# Altium schematic sheet buck_boost_converter.SchDoc
size 297 x 209 mm; DrawnBy: Supun; Engineer: Supun; Organization: C3
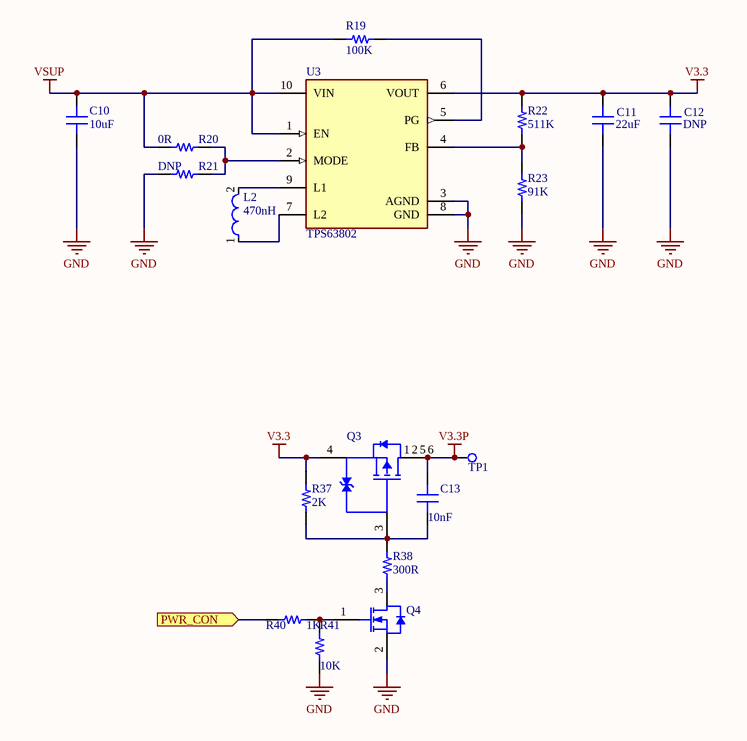
[diagram p0: buck_boost_converter.SchDoc]

## Parts
C10  10uF  [CAP 0603_1608]
C11  22uF  [CAP 0603_1608]
C12  DNP  [CAP 0603_1608]
C13  10nF  [CAP 0603_1608]
L2  470nH  [Coilcraft_XFL4015_MFG]
Q3  P Mosfet  [Diodes_Inc._TSOT26_MFG]  (value not drawn)
Q4  N Mosfet  [ON SEMI SOT-23-3]  (value not drawn)
R19  100K  [RES 0603_1608]
R20  0R  [RES 0603_1608]
R21  DNP  [RES 0603_1608]
R22  511K  [RES 0603_1608]
R23  91K  [RES 0603_1608]
R37  2K  [RES 0603_1608]
R38  300R  [RES 0603_1608]
R40  1K  [RES 0603_1608]
R41  10K  [RES 0603_1608]
TP1  Test Point  [TPSMD_S1]  (value not drawn)
U3  TPS63802  [Texas_Instruments_DLA0010A_MFG]

## Ports
PWR_CON (in)

## Nets
GND: C10.2 C11.2 C12.2 Q4.2(S) R21.1 R23.2 R41.1 U3.3(AGND) U3.8(GND)
V3.3: C11.1 C12.1 Q3.4(S) R22.1 R37.1 U3.6(VOUT)
V3.3P: C13.1 Q3.1(D) Q3.2(D) Q3.5(D) Q3.6(D) TP1.1(TP)
VSUP: C10.1 R19.1 R20.1 U3.1(EN) U3.10(VIN)
PWR_CON: R40.1 ; port PWR_CON
NetC13_2: C13.2 Q3.3(G) R37.2 R38.2
NetL2_1: L2.1 U3.7(L2)
NetL2_2: L2.2 U3.9(L1)
NetQ4_1: Q4.1(G) R40.2 R41.2
NetQ4_3: Q4.3(D) R38.1
NetR19_2: R19.2 U3.5(PG)
NetR20_2: R20.2 R21.2 U3.2(MODE)
NetR22_2: R22.2 R23.1 U3.4(FB)

## Notes on the sheet
- Title
- Size:
- Date:
- A4
- Number:
- Time:
- Revision:
- Sheet
- of
- File:

## Library data of the parts
C10 = Capacitor: SMT Capacitor; MF: Murata; MP: GRM188R61C106MAALD; Value: 10uF; Link: https://www.mouser.com/ProductDetail/Murata-Electronics/GRM188R61C106MAALD?qs=hNud%2FORuBR3LEOKZ4RJp9w%3D%3D
C11 C12 = Capacitor: SMT Capacitor; MF: Murata; MP: GRM188R61A226ME15D; Link: https://www.mouser.com/ProductDetail/Murata-Electronics/GRM188R61A226ME15D?qs=eeBpzGFlv%252B8DV%2FrilzyhAw%3D%3D
  C11: Value: 22uF
  C12: Value: DNP
C13 = Capacitor: SMT Capacitor; MF: Murata; MP: GRM1885C1E103JA01D; Value: 10nF; Link: https://www.mouser.com/ProductDetail/Murata-Electronics/GRM1885C1E103JA01D?qs=ui%252B2d9lVEI4mHR%2FJ9wCzmw%3D%3D
L2 = Inductor_sm: Fixed Inductors 2.2uH 20% High Temp AEC-Q200; MF: Coilcraft; MP: XFL4015-471MEC; Value: 470nH; Link: https://www.mouser.com/ProductDetail/Coilcraft/XFL4015-471MEC?qs=zCSbvcPd3pYzCOJSVbeMnw%3D%3D
Q3 = Mosfet-P-6_ESD: P-Channel Enhancement Mode MOS Transistor, 3-Pin SOT23; MF: Vishay; MP: SI3421DV-T1-GE3; Value: P Mosfet; Link: https://www.mouser.com/ProductDetail/Vishay-Semiconductors/SI3421DV-T1-GE3?qs=dpt6vIvaxwjvmZPXyyVpRg%3D%3D
Q4 = Mosfet-N: N-Channel Enhancement Mode MOS Transistor, 30 V, 0.85 A, 3-Pin SOT23, Tape and Reel; Coss [typ] (pF): 27; Ciss [typ] (pF): 83; Packing: Tape & Reel; ID [max] (A): 0.85; VDS [max] (V): 30; MF: Diodes; MP: DMN2053U-7; ComponentLink1Description: Manufacturer URL; ComponentLink2Description: Datasheet; ComponentLink3Description: Package Specification; ComponentLink3URL: http://www.nxp.com/documents/outline_drawing/sot023_po.pdf; ComponentLink1URL: http://www.nxp.com/; ComponentLink2URL: http://www.nxp.com/documents/data_sheet/BSH103.pdf; PackageReference: SOT23; Channel Type: N; Code_JEDEC: TO-236AB; Mounting Technology: Surface Mount; PackageDescription: 3-Pin Small Outline Transistor Package, Body 2.9 x 1.3 mm, Pitch 0.95 mm; PackageVersion: 06-03-16, 03/2006; Value: N Mosfet; Link: https://www.mouser.com/ProductDetail/Diodes-Incorporated/DMN2053U-7?qs=y6ZabgHbY%252BwZqQYPRB57iA%3D%3D
R19 = Resistor: SMT Resistor; MF: YAGEO; MP: AC0603FR-07100KL; Value: 100K; Link: https://www.mouser.com/ProductDetail/YAGEO/AC0603FR-07100KL?qs=UoPT7wUmgYKBKZ83mTH%252BSA%3D%3D
R20 R21 = Resistor: SMT Resistor; MF: YAGEO; MP: AC0603FR-070RL; Link: https://www.mouser.com/ProductDetail/YAGEO/AC0603FR-070RL?qs=UoPT7wUmgYIHE8YhvUntLg%3D%3D
  R20: Value: 0R
  R21: Value: DNP
R22 = Resistor: SMT Resistor; MF: YAGEO; MP: AC0603FR-07511KL; Value: 511K; Link: https://www.mouser.com/ProductDetail/YAGEO/AC0603FR-07511KL?qs=sGAEpiMZZMvdGkrng054twVr7TWeaA0slq%2FUVYWFkhk%3D
R23 = Resistor: SMT Resistor; MF: YAGEO; MP: AC0603FR-0791KL; Value: 91K; Link: https://www.mouser.com/ProductDetail/YAGEO/AC0603FR-0791KL?qs=sGAEpiMZZMvdGkrng054t2uy2SOblyUPa6Z36%252BTPeHc%3D
R37 = Resistor: SMT Resistor; MF: YAGEO; MP: AC0603FR-072KL; Value: 2K; Link: https://www.mouser.com/ProductDetail/YAGEO/AC0603FR-072KL?qs=ygRr%2FtkhtesLR2bjSRHyag%3D%3D
R38 = Resistor: SMT Resistor; MF: YAGEO; MP: AC0603FR-07300RL; Value: 300R; Link: https://www.mouser.com/ProductDetail/YAGEO/AC0603FR-07300RL?qs=yhV1fb9g%2FKYRCKndxB9juA%3D%3D
R40 = Resistor: SMT Resistor; MF: YAGEO; MP: AC0603FR-071KL; Value: 1K; Link: https://www.mouser.com/ProductDetail/YAGEO/AC0603FR-071KL?qs=UoPT7wUmgYJx4gI0q%252BcIRQ%3D%3D
R41 = Resistor: SMT Resistor; MF: YAGEO; MP: AC0603FR-0710KL; Value: 10K; Link: https://www.mouser.com/ProductDetail/YAGEO/AC0603FR-0710KL?qs=UoPT7wUmgYKz3zh0UDMA4Q%3D%3D
U3 = TPS63802: Switching Voltage Regulators 2-A, high-efficient, 11- uA quiescent current buck-boost converter in QFN/DFN package 10-VSON-HR -40 to 125; MF: Texas Instruments; MP: TPS63802DLAT; Value: *; Link: https://www.mouser.com/ProductDetail/Texas-Instruments/TPS63802DLAT?qs=9r4v7xj2LnmaSyyQsA%2FrUA%3D%3D
TP1 = Test Point: Link: https://